# Altium project FM Transmitter.PrjPcb
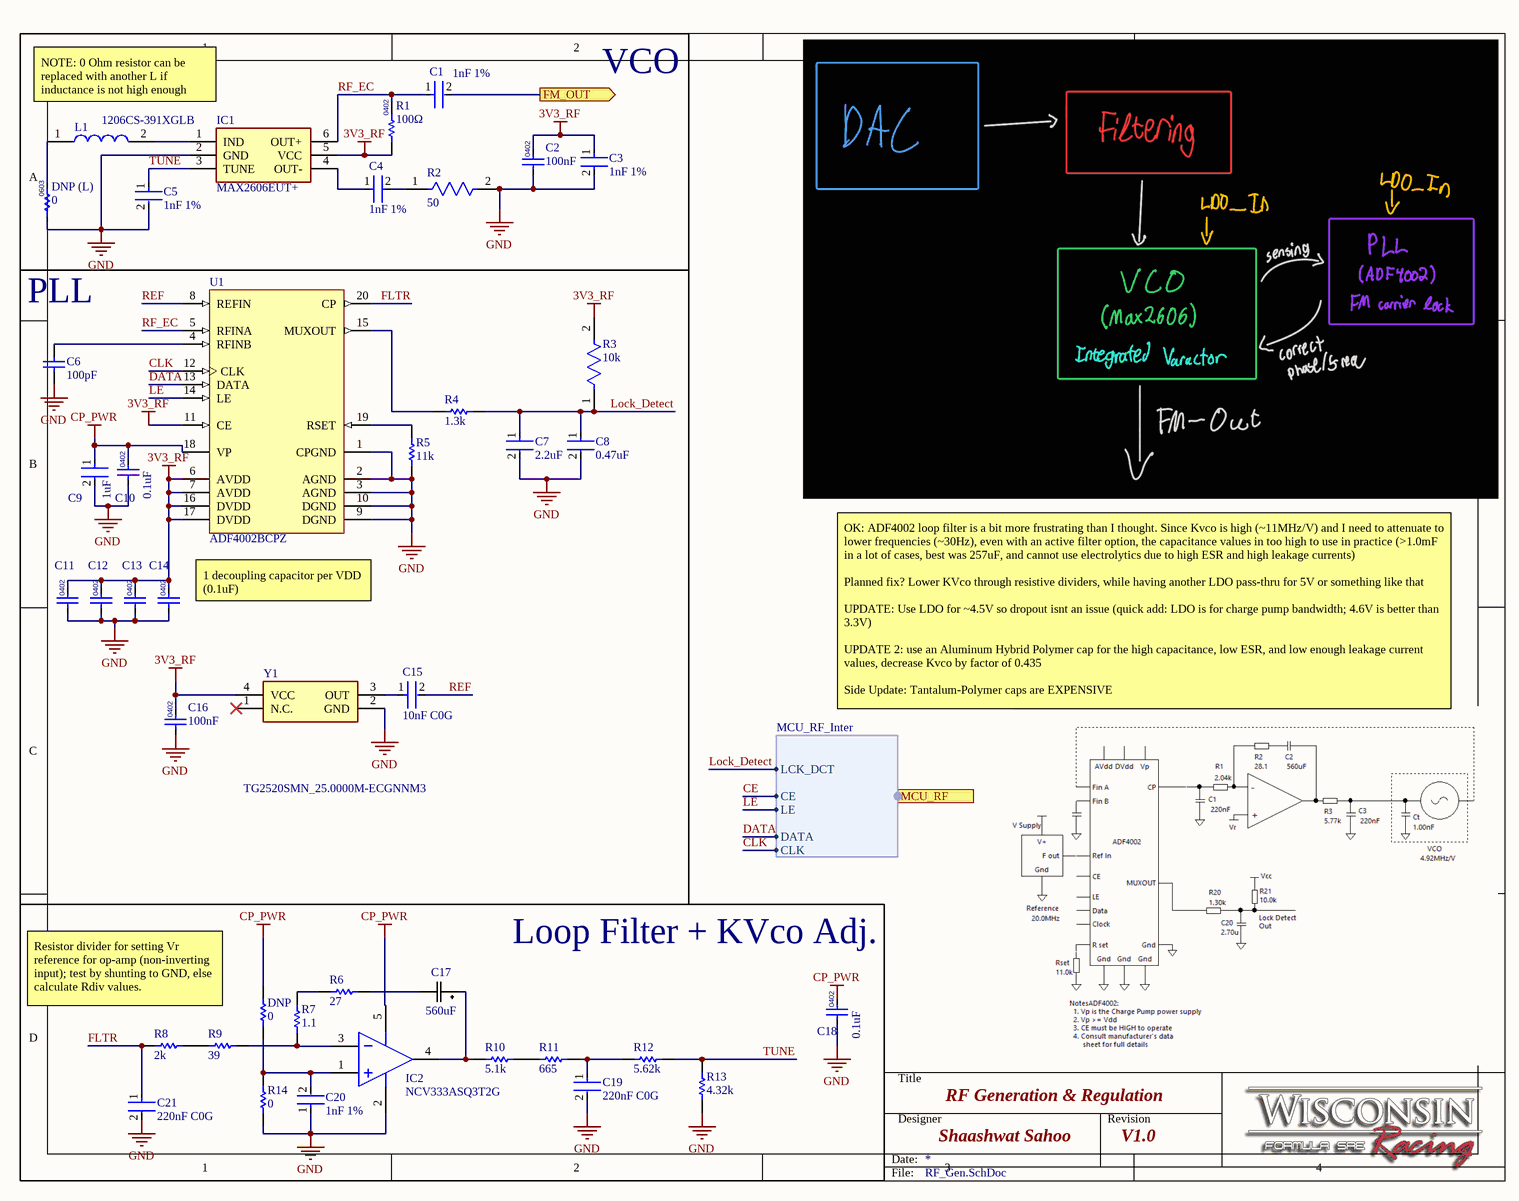
[diagram p0: RF_Gen.SchDoc]
3 sheets, 62 parts. Net scope: flat (ports and power ports of the same name join across sheets).
Sheets:
  RF_Gen.SchDoc
  DAC.SchDoc
  MCU.SchDoc

## Sheet RF_Gen.SchDoc: RF Generation & Regulation
size 279 x 215 mm; Engineer: Shaashwat Sahoo; Revision: V1.0; SheetNumber: 1; SheetTotal: 5; SPICEModelCacheMXYIGOMC: <root> / <DocumentId>MXYIGOMC</DocumentId> / <CacheFrame Number="0"> / <Model Name="cap" Kind="MDL"> / <Text>*Default semiconductor capacitor / .MODEL CAP C()</Text> / </Model> / </CacheFrame> / </root>

### Parts
(Parts that share a designator on the sheet are numbered #1, #2 ... from top to bottom, then left to right.)
C1  1nF 1%  [FP-GRT155-0_05-IPC_A]
C2  100nF  [FP-CC0402-IPC_B]
C3  1nF 1%  [FP-GRT155-0_05-IPC_A]
C4  1nF 1%  [FP-GRT155-0_05-IPC_A]
C5  1nF 1%  [FP-GRT155-0_05-IPC_A]
C6  100pF  [CAPC1005X55X25ML05T10]
C7  2.2uF  [FP-CC0402-MFG]
C8  0.47uF  [FP-GRM155-0_1-IPC_B]
C9  1uF  [FP-GRM155-0_1-IPC_A]
C10  0.1uF  [FP-CC0402-IPC_B]
C11  0.1uF  [FP-CC0402-IPC_B]  (value not drawn)
C12  0.1uF  [FP-CC0402-IPC_B]  (value not drawn)
C13  0.1uF  [FP-CC0402-IPC_B]  (value not drawn)
C14  0.1uF  [FP-CC0402-IPC_B]  (value not drawn)
C15  10nF C0G  [FP-GRM155-0_15-MFG]
C16  100nF  [FP-CC0402-IPC_B]
C17  560uF  [CAP_GY_10X10_NCH]
C18  0.1uF  [FP-CC0402-IPC_B]
C19  220nF C0G  [FP-GRM31C-0_2-e0_3_0_8-IPC_B]
C20  1nF 1%  [FP-GRT155-0_05-IPC_A]
C21  220nF C0G  [FP-GRM31C-0_2-e0_3_0_8-IPC_B]
DNP#1  0  [RESC1005X40X25NL05T10]
DNP_(L)  0  [Res0603-type-2]
IC1  MAX2606EUT+  [SOT95P280X145-6N]
IC2  NCV333ASQ3T2G  [SOT65P210X110-5N]
L1  1206CS-391XGLB  [INDC3622X152N]
R1  value 100Ω  [RESC1005X40X25NL05T10]  (hidden comment: 100 1%)
R2  50  [FP-AC0402-IPC_C]
R3  10k  [FP-AC0402-MFG]
R4  1.3k  [RESC1005X40X25ML05T10]
R5  11k  [RESC1005X40X25NL05T10]
R6  27  [RESC1005X40X25LL05T10]
R7  1.1  [RESC1005X40X25NL05T10]
R8  2k  [RESC1005X35X25NL10T10]
R9  39  [RESC1005X40X25LL05T10]
R10  5.1k  [RESC1005X40X25NL05T10]
R11  665  [RESC1005X40X25ML05T10]
R12  5.62k  [RESC1005X40X25LL05T10]
R13  4.32k  [RESC1005X40X25NL05T10]
R14  0  [RESC1005X40X25NL05T10]
U1  ADF4002BCPZ  [ADI-CP-20-1_M]
Y1  TG2520SMN_25.0000M-ECGNNM3  [TG2520SMN250000MECGNNM3]

### Blocks framed on the sheet
VCO: C1-C5 DNP_(L) IC1 L1 R1 R2
PLL: C6-C16 R3-R5 U1 Y1
Loop Filter + KVco Adj.: C17-C21 DNP#1 IC2 R6-R14

### Ports
FM_OUT (out), MCU_RF (harness MCU_RF_Inter)

### Harnesses
MCU_RF_Inter: LCK_DCT, LE, DATA, CLK, CE

### Nets
3V3_RF: C2.2 C3.1 C11.2 C12.2 C13.2 C14.2 C16.2 IC1.5(VCC) R1.1 R3.2 U1.6(AVDD) U1.7(AVDD) U1.11(CE) U1.16(DVDD) U1.17(DVDD) Y1.4(VCC)
CP_PWR: C9.1 C10.2 C18.2 DNP#1.2 IC2.5(V-) U1.18(VP)
GND: C2.1 C3.2 C5.2 C6.2 C7.2 C8.2 C9.2 C10.1 C11.1 C12.1 C13.1 C14.1 C16.1 C18.1 C19.2 C20.1 C21.2 DNP_(L).1 IC1.2(GND) IC2.2(V-) R2.2 R5.1 R13.1 R14.1 U1.1(CPGND) U1.2(AGND) U1.3(AGND) U1.9(DGND) U1.10(DGND) Y1.2(GND)
CE: port MCU_RF.CE
CLK: U1.12(CLK) ; port MCU_RF.CLK
DATA: U1.13(DATA) ; port MCU_RF.DATA
FLTR: C21.1 R8.1 U1.20(CP)
LE: U1.14(LE) ; port MCU_RF.LE
Lock_Detect: C7.1 C8.1 R3.1 R4.2 ; port MCU_RF.LCK_DCT
REF: C15.2 U1.8(REFIN)
RF_EC: C1.1 IC1.6(OUT+) R1.2 U1.5(RFINA)
TUNE: C5.1 IC1.3(TUNE) R12.2 R13.2
NetC1_2: C1.2 ; port FM_OUT
NetC4_1: C4.1 IC1.4(OUT-)
NetC4_2: C4.2 R2.1
NetC6_1: C6.1 U1.4(RFINB)
NetC15_1: C15.1 Y1.3(OUT)
NetC17_1: C17.1 IC2.4(OUT) R10.1
NetC17_2: C17.2 R6.2
NetC19_1: C19.1 R11.2 R12.1
NetC20_2: C20.2 DNP#1.1 IC2.1(IN+) R14.2
NetDNP_(L)_2: DNP_(L).2 L1.1
NetIC1_1: IC1.1(IND) L1.2
NetIC2_3: IC2.3(IN-) R7.1 R9.2
NetR4_1: R4.1 U1.15(MUXOUT)
NetR5_2: R5.2 U1.19(RSET)
NetR6_1: R6.1 R7.2
NetR8_2: R8.2 R9.1
NetR10_2: R10.2 R11.1

Not connected (* = marked no-connect by the designer): Y1 1(N.C.)*

### Notes on the sheet
- NOTE: 0 Ohm resistor can be replaced with another L if inductance is not high enough
- 1 decoupling capacitor per VDD (0.1uF)
- OK: ADF4002 loop filter is a bit more frustrating than I thought. Since Kvco is high (~11MHz/V) and I need to attenuate to lower frequencies (~30Hz), even with an active filter option, the capacitance values in too high to use in practice (>1.0mF in a lot of cases, best was 257uF, and cannot use electrolytics due to high ESR and high leakage currents)
  Planned fix? Lower KVco through resistive dividers, while having another LDO pass-thru for 5V or something like that
  UPDATE: Use LDO for ~4.5V so dropout isnt an issue (quick add: LDO is for charge pump bandwidth; 4.6V is better than 3.3V)
  UPDATE 2: use an Aluminum Hybrid Polymer cap for the high capacitance, low ESR, and low enough leakage current values, decrease Kvco by factor of 0.435
  Side Update: Tantalum-Polymer caps are EXPENSIVE
- Resistor divider for setting Vr reference for op-amp (non-inverting input); test by shunting to GND, else calculate Rdiv values.
- Title
- Designer
- Revision
- Date:
- File:
- (in symbol CMP-Cap-00006-1) 0402
- (in symbol CMP-Res-00022-2) 0603

### Library data of the parts
C1 C3-C5 C20 = CMP-06035-012909-1: Multi-Layer Ceramic Capacitor 1nF 50V C0G ±1% 0402 Paper T/R / GRT1555C1H102FA02D
C2 C16 = CMP-Cap-00006-1: Ceramic Capacitor, Multilayer, Ceramic, 16V, 10% +Tol, 10% -Tol, X7R, 15% TC, 0.1uF, Surface Mount, 0402; Dielectric: XR7; Tolerance: 10%; Capacitance: 100nF; Voltage Rating: 16V
C6 = CMP-2008-03915-1: Manufacturer: Murata; Part Number: GRM1555C1H101JA01D
C7 = CMP-03422-000618-1: CAP CER 2.2UF 10V X5R 0402; Manufacturer: YAGEO; Manufacturer Part Number: CC0402KRX5R6BB225; Automotive Grade: NA; Temperature Coefficient: 30ppm/°C; Tolerance: 0.1; Material: Ceramic; Automotive: No; Device Class L1: Passive Components; Footprint Url: http://www.yageo.com/exep/pages/download/literatures/UPY-C_GEN_24.pdf; Height: 0.55mm; Temperature Range High: +125°C; Category: Cap; ComponentLink2Description: Datasheet; Lead Free: Yes; Octopart: https://octopart.com/cc0402krx5r6bb225-yageo-30987418; Value: 2.2 uF; Ipc Land Pattern Name: CAPC10050X50; Device Class L3: Ceramic Capacitors; Temperature Characteristic: X5R; Device Class L2: Capacitors; Package: CC0402; RoHS: TRUE; Capacitance: 2.2 uF; Temperature: -55°C to +125°C; Digikey Description: CAP CER 2.2UF 10V X5R 0402; Mouser Description: CC Series 0402 2.2 uF 10 V ±10% Tolerance X5R Multilayer Ceramic Capacitor; Voltage Rating: 10 V; ComponentLink2URL: http://www.yageo.com/documents/recent/UPY-GP_NP0_16V-to-50V_16.pdf; Temperature Range Low: -55°C
C8 = CMP-06035-008741-1: Chip Multilayer Ceramic Capacitors for General Purpose, 0402, 0.47uF, X5R, 15%, 10%, 50V; Capacitance: 470nF; Dielectric: X5R; Voltage Rating (DC): 50V; Width: 500um; Tolerance: 10%; Length: 1mm; Thickness: 500um
C9 = CMP-06035-012596-1: Chip Multilayer Ceramic Capacitors for General Purpose, 0402, 1.0uF, X7R, 15%, 10%, 10V
C10-C14 C18 = CMP-Cap-00006-1: Ceramic Capacitor, Multilayer, Ceramic, 16V, 10% +Tol, 10% -Tol, X7R, 15% TC, 0.1uF, Surface Mount, 0402; Dielectric: XR7; Capacitance: 100nF; Tolerance: 10%; Voltage Rating: 16V
C15 = CMP-06035-053372-1: Chip Multilayer Ceramic Capacitors for General Purpose, 0402, 10000pF, C0G, 30ppm/°C, 5%, 35V
C17 = CMP-034-000012-1: Description; Manufacturer_Name: Nichicon; Copyright: Copyright (C) 2025 Ultra Librarian. All rights reserved.; Design Item ID: GYB1J560MCQ1GS; Manufacturer_Part_Number: GYB1J560MCQ1GS; Source: GYB1J560MCQ1GS.SchLib
C19 C21 = CMP-06035-005862-1: Chip Multilayer Ceramic Capacitors for General Purpose, 1206, 0.22uF, C0G, 30ppm/°C, 5%, 25V
DNP#1 R14 = CMP-1011-00001-2: Manufacturer: Yageo / Phycomp; Part Number: RC0402JR-070RL
DNP_(L) = CMP-Res-00022-2: Fixed Resistor, Metal Glaze/thick Film, 0.1W, 0ohm, Surface Mount, 0603; Tolerance: 0.1%; Power: 100mW; Resistance: 0
IC1 = MAX2606EUT+: Integrated Circuit; Manufacturer_Name: Analog Devices; Datasheet Link: https://datasheets.maximintegrated.com/en/ds/MAX2605-MAX2609.pdf; Height: 1.45mm; Manufacturer_Part_Number: MAX2606EUT+; Mouser Part Number: 700-MAX2606EUT+; Mouser Price/Stock: https://www.mouser.co.uk/ProductDetail/Analog-Devices-Maxim-Integrated/MAX2606EUT%2b?qs=U8%2FOE6X5Fv%2F2oJ3nHVn6vA%3D%3D
IC2 = CMP-006-000098-2: Low Offset Voltage: 10 V max (NCS333); Manufacturer_Name: onsemi; Design Item ID: NCV333ASQ3T2G; Manufacturer_Part_Number: NCV333ASQ3T2G; Source: SamacSys.SchLib; Datasheet Link: https://www.onsemi.com/pub/Collateral/NCS333-D.PDF; Height: 1.1mm; Arrow Part Number: NCV333ASQ3T2G; Arrow Price/Stock: https://www.arrow.com/en/products/ncv333asq3t2g/on-semiconductor?region=nac; Mouser Part Number: 863-NCV333ASQ3T2G; Mouser Price/Stock: https://www.mouser.co.uk/ProductDetail/onsemi/NCV333ASQ3T2G?qs=f9yNj16SXrKU9Ty3EUv2qA%3D%3D
L1 = 1206CS-391XGLB: Inductor; Manufacturer_Name: COILCRAFT; Datasheet Link: https://componentsearchengine.com/Datasheets/2/1206CS-391XGLB.pdf; Height: 1.52mm; Manufacturer_Part_Number: 1206CS-391XGLB
R1 = CMP-00174-2: Res Thick Film 0402 100 Ohm 1% 0.063W(1/16W) ±100ppm/C Pad SMD T/R; Power Rating: 63mW; Power Dissipation: 62.5mW; Working Voltage: 50V; Temperature Coefficient: 100ppm/°C; Harmonized Tariff Schedule (HTS) Code: 8533.21.00.30; Case/Package: 0402; Lifecycle Status: Production; Export Control Classification Number (ECCN) Code: EAR99; Number of Terminals: 2; Max Operating Temperature: 155°C; Military Standard: Not; Tolerance: 1%; China RoHS: Non-Compliant; Case Code (Imperial): 0402; Width: 500µm; Lead Free: Lead Free; Voltage Rating: 50V; Country of Origin: Mainland China, Taiwan; Composition: Thick Film; Mounting Technology: Surface Mount; Termination: SMD/SMT; RoHS: Compliant; Height: 350µm; Min Operating Temperature: -55°C; Voltage Rating (DC): 50V; REACH SVHC: Yes; Packaging: Tape & Reel; Schedule B: 8533210045, 8533210045; Length: 1mm; Introduction Date: 2004-10-04; Pins: 2; Depth: 500µm
R2 = CMP-2002-01779-2: RES 50Ω ±5% 0.063W 0402 / AC0402JR-0750RL; Voltage Rating: 50V; Power Rating: 62.5mW; Max Power Dissipation: 63mW; Temperature Coefficient: 100ppm/°C; Resistance: 50R; Termination: SMD/SMT; Packaging: Tape and Reel; Case Code (Metric): 1005; Min Operating Temperature: -55°C; Case/Package: 0402; Length: 0.039inch; Series: AC; Number of Terminations: 2; Weight: 2.3E-05oz; Tolerance: 5%; Max Operating Temperature: 155°C; Features: Moisture Resistant; Width: 0.5mm; Height: 0.015inch; Resistor Type: Thick Film; Lead Free: Lead Free; Case Code (Imperial): 0402; RoHS Compliant: Yes
R3 = CMP-2002-01790-3: RES 10kΩ ±1% 0.063W 0402; Power Rating: 62.5mW; Voltage Rating: 50V; Temperature Coefficient: 100ppm/°C; Resistance: 10kR; Max Power Dissipation: 63mW; Tolerance: 1%; Military Standard: Not; Construction: Rectangular; Termination: SMD/SMT; Max Operating Temperature: 155°C; Min Operating Temperature: -55°C; Height: 0.015inch; Lead Free: Lead Free; Width: 0.02inch; Case/Package: 0402; Resistor Type: Thick Film; Series: AC; Features: Moisture Resistant; RoHS Compliant: Yes; Number of Terminations: 2; Case Code (Metric): 1005; Length: 0.039inch; Depth: 0.5mm; Size Code: 0402; Packaging: Tape and Reel; Case Code (Imperial): 0402
R4 = CMP-2002-07459-1: Manufacturer: Yageo / Phycomp; Part Number: RC0402FR-071K3L
R5 R10 = CMP-2002-07753-1: Part Number: RC0402FR-075K1L; Manufacturer: Yageo / Phycomp
R6 = CMP-2002-07055-1: Part Number: RC0402FR-0727RL; Manufacturer: Yageo / Phycomp
R7 = CMP-1011-00175-2: Part Number: RC0402FR-071R1L; Manufacturer: Yageo / Phycomp
R8 = CMP-2002-02941-1: Manufacturer: Yageo; Part Number: RT0402BRD072KL
R9 = CMP-1011-00350-2: Manufacturer: Yageo / Phycomp; Part Number: RC0402FR-0739RL
R11 = CMP-2002-07113-1: Part Number: RC0402FR-07665RL; Manufacturer: Yageo / Phycomp
R12 = CMP-2002-07755-1: Part Number: RC0402FR-075K62L; Manufacturer: Yageo / Phycomp
R13 = CMP-1011-00582-2: Part Number: RC0402FR-074K32L; Manufacturer: Yageo / Phycomp
U1 = CMP-0287-00012-1: Phase Detector/Frequency Synthesizer, CP-20-1, Pb-Free, 490 Tray; Max REFin (MHz): 300MHz; Supply Current: 5mA; Norm Phase Noise (dBc/Hz): -222dBc; Max RF Input (MHz): 400MHz; Frequency Range: 5MHz-400MHz; Single/Dual: Single; PackageReference: CP-20-1; Code_JEDEC: MO-220-VGGD-1; ComponentLink1URL: www.analog.com; ComponentLink3Description: Package Specification; PackageVersion: 012508-B; DatasheetVersion: Rev. B; ComponentLink3URL: http://www.analog.com/static/imported-files/packages/PKG_PDF/LFCSP(CP)/CP_20_1.pdf; ComponentLink2Description: Datasheet; ComponentLink1Description: Manufacturer URL; PackageDescription: 20-Lead Lead Frame Chip Scale Package [LFCSP_VQ]; ComponentLink2URL: http://www.analog.com/static/imported-files/data_sheets/ADF4002.pdf
Y1 = TG2520SMN_25.0000M-ECGNNM3: Crystal or Oscillator; Manufacturer_Name: Epson Timing; Manufacturer_Part_Number: TG2520SMN 25.0000M-ECGNNM3; Datasheet Link: https://au.mouser.com/datasheet/2/137/Epson_TG2016SMN_en_1649545-1889946.pdf; Height: 0.8mm; Mouser Part Number: 732-TG252S25ECGNNM3; Mouser Price/Stock: https://www.mouser.co.uk/ProductDetail/Epson-Timing/TG2520SMN-25.0000M-ECGNNM3?qs=d0WKAl%252BL4KZiXJ1i3MlmDQ%3D%3D

## Sheet DAC.SchDoc
size 279 x 215 mm; SheetNumber: 4; SheetTotal: 6; SPICEModelCacheRUGZJIPY: <root> / <DocumentId>RUGZJIPY</DocumentId> / <CacheFrame Number="0"> / <Model Name="cap" Kind="MDL"> / <Text>*Default semiconductor capacitor / .MODEL CAP C()</Text> / </Model> / </CacheFrame> / </root>
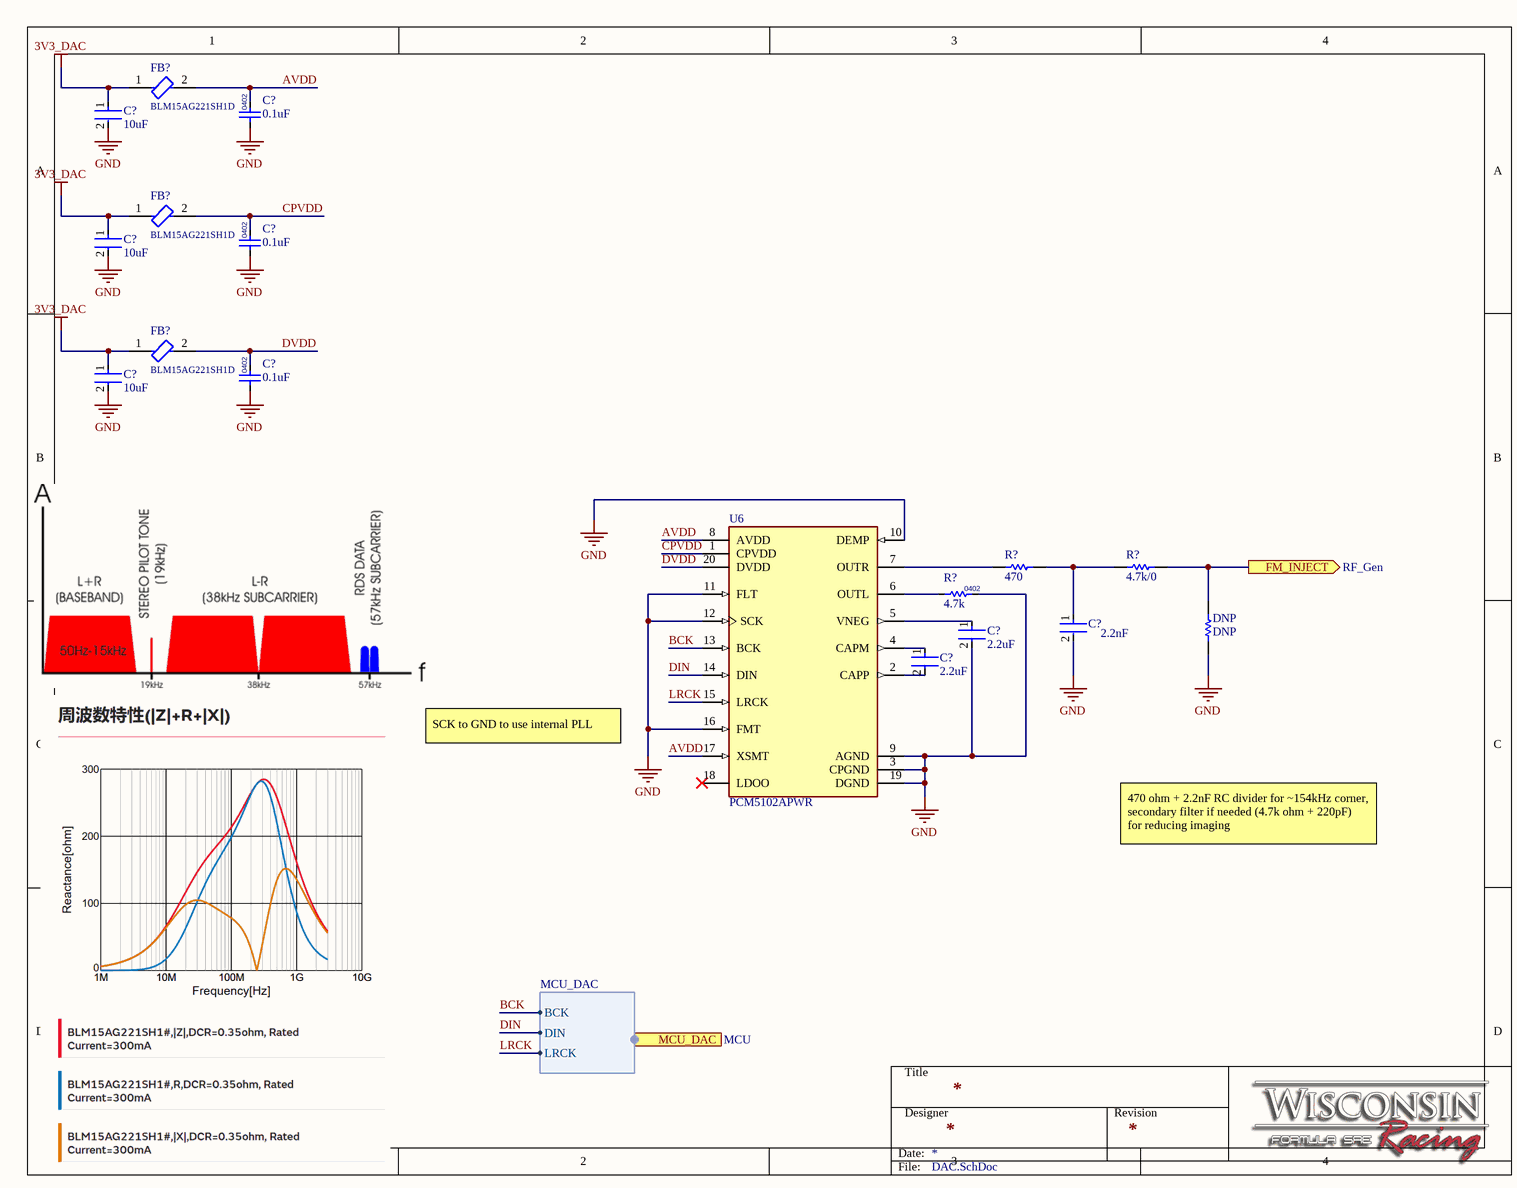
[diagram p1: DAC.SchDoc]

### Parts
(Parts that share a designator on the sheet are numbered #1, #2 ... from top to bottom, then left to right.)
C?#1  10uF  [FP-GRM155-0_2-IPC_A]
C?#2  0.1uF  [FP-CC0402-IPC_B]
C?#3  10uF  [FP-GRM155-0_2-IPC_A]
C?#4  0.1uF  [FP-CC0402-IPC_B]
C?#5  10uF  [FP-GRM155-0_2-IPC_A]
C?#6  0.1uF  [FP-CC0402-IPC_B]
C?#7  2.2nF  [FP-GRM155-0_05-IPC_C]
C?#8  2.2uF  [FP-GRM155-0_2-IPC_B]
C?#9  2.2uF  [FP-GRM155-0_2-IPC_B]
DNP#2  DNP  [RESC1005X40X25NL05T10]
FB?#1  BLM15AG221SH1D  [FP-BLM15-0_05-MFG]
FB?#2  BLM15AG221SH1D  [FP-BLM15-0_05-MFG]
FB?#3  BLM15AG221SH1D  [FP-BLM15-0_05-MFG]
R?#1  470  [RESC1005X40X25ML05T10]
R?#2  4.7k/0  [RESC1005X40X25NL05T10]
R?#3  value 4.7k  [RESC1005X40X25NL05T10]  (hidden comment: 4.7k 1%)
U6  PCM5102APWR  [FP-PW0020A-IPC_A]

### Ports
FM_INJECT (out, see RF_Gen), MCU_DAC (harness MCU_DAC, see MCU)

### Harnesses
MCU_DAC: BCK, DIN, LRCK

### Nets
3V3_DAC: C?#1.1 C?#3.1 C?#5.1 FB?#1.1 FB?#2.1 FB?#3.1
GND: C?#1.2 C?#2.1 C?#3.2 C?#4.1 C?#5.2 C?#6.1 C?#7.2 C?#8.2 DNP#2.1 R?#3.2 U6.3(CPGND) U6.9(AGND) U6.10(DEMP) U6.11(FLT) U6.12(SCK) U6.16(FMT) U6.19(DGND)
AVDD: C?#2.2 FB?#1.2 U6.8(AVDD) U6.17(XSMT)
BCK: U6.13(BCK) ; port MCU_DAC.BCK
CPVDD: C?#4.2 FB?#2.2 U6.1(CPVDD)
DIN: U6.14(DIN) ; port MCU_DAC.DIN
DVDD: C?#6.2 FB?#3.2 U6.20(DVDD)
LRCK: U6.15(LRCK) ; port MCU_DAC.LRCK
NetC?#7_1: C?#7.1 R?#1.2 R?#2.1
NetC?#8_1: C?#8.1 U6.5(VNEG)
NetC?#9_1: C?#9.1 U6.4(CAPM)
NetC?#9_2: C?#9.2 U6.2(CAPP)
NetDNP#2_2: DNP#2.2 R?#2.2 ; port FM_INJECT
NetR?#1_1: R?#1.1 U6.7(OUTR)
NetR?#3_1: R?#3.1 U6.6(OUTL)

Not connected (* = marked no-connect by the designer): U6 18(LDOO)*

### Notes on the sheet
- SCK to GND to use internal PLL
- 470 ohm + 2.2nF RC divider for ~154kHz corner, secondary filter if needed (4.7k ohm + 220pF)  for reducing imaging
- Title
- Designer
- Revision
- Date:
- File:
- (in symbol CMP-Cap-00006-1) 0402

### Library data of the parts
C?#1 C?#3 C?#5 = CMP-06035-061139-1: Chip Multilayer Ceramic Capacitors for General Purpose, 0402, 10uF, X5R, 15%, 20%, 6.3V
C?#2 C?#4 C?#6 = CMP-Cap-00006-1: as C10 on sheet RF_Gen; Tolerance: 10%; Voltage Rating: 16V
C?#7 = CMP-06035-062041-1: Chip Multilayer Ceramic Capacitors for General Purpose, 0402, 2200pF, C0G, 30ppm/°C, 5%, 50V
C?#8 C?#9 = CMP-06035-003072-1: Chip Multilayer Ceramic Capacitors for General Purpose, 0402, 2.2uF, X7R, 15%, 10%, 10V; Case/Package: 0402
DNP#2 R?#2 = CMP-1011-00001-2: as DNP#1 on sheet RF_Gen
FB?#1-FB?#3 = CMP-06046-002173-1: Chip Ferrite Bead, 0402, 220Ω @ 100MHz, 0.35Ω, 25%, 300mA; Impedance: 220R; Number of Lines: 1; DC Resistance (DCR): 350mR; Package Quantity: 10000; Max Operating Temperature: 125°C; Case Code (Imperial): 0402; Ratings: AEC-Q200; Packaging: Tape and Reel; Width: 0.5mm; Core Material: Ferrite; Length: 0.039inch; Max Current Rating: 300mA; REACH SVHC: No SVHC; Weight: 2.3E-05oz; Height: 0.022inch; Max DC Current: 300mA; Series: EMIFIL®, BLM15A_SH; Test Frequency: 100MHz; Min Operating Temperature: -55°C; Termination: SMD/SMT; Mount: Surface Mount; Case Code (Metric): 1005; Depth: 0.55mm; Case/Package: 0402; RoHS Compliant: Yes; Tolerance: 25%; Number of Circuits: 1
R?#1 = CMP-2002-07697-1: Part Number: RC0402FR-07470RL; Manufacturer: Yageo / Phycomp
R?#3 = CMP-00178-1: Res General Purpose Thick Film 0402 4.7K Ohm 1% 1/16W ±100ppm/°C Molded SMD Paper T/R; Power Rating: 63mW; Voltage Rating (AC): 50V; Power Dissipation: 62.5mW; REACH SVHC: Yes; Harmonized Tariff Schedule (HTS) Code: 8533.21.00.30; Composition: Thick Film; Max Operating Temperature: 155°C; Number of Terminals: 2; Min Operating Temperature: -55°C; Depth: 500µm; Introduction Date: 2008-07-18; Case Code (Metric): 1005; Pins: 2; Packaging: Tape & Reel; Height: 350µm; China RoHS: Non-Compliant; Lead Free: Lead Free; Termination: SMD/SMT; Tolerance: 1%; Schedule B: 8533210045, 8533210045; Length: 1mm; Lifecycle Status: Production; Case Code (Imperial): 0402; RoHS: Compliant; Width: 500µm; Mounting Technology: Surface Mount; Temperature Coefficient: 100ppm/°C; Export Control Classification Number (ECCN) Code: EAR99; Country of Origin: Mainland China, Taiwan; Working Voltage: 50V; Voltage Rating: 50V; Case/Package: 0402; Voltage Rating (DC): 50V; Military Standard: Not
U6 = CMP-04861-000013-1: IC DAC 16/24/32BIT 384K 20TSSOP; Power Consumption: 59.4mW; Number of Analog Inputs: 0; Supply Type: Analog; Resolution: 32b; Number of Analog Outputs: 2; Max Power Dissipation: 187mW; Sampling Rate: 384KS/s; Operating Supply Voltage: 3.3V; Number of Bits: 32; Max Supply Voltage: 3.6V; Interface: Serial; Polarity: Unipolar; Min Supply Voltage: 3V; Output Type: Voltage; Signal to Noise Ratio (SNR): 112dB; Contact Plating: Gold; Package Quantity: 2000; Number of Pins: 20; Max Operating Temperature: 85°C; Series: DirectPath™; Case/Package: TSSOP; Conversion Rate: 384KS/s; Number of DAC Channels: 2; Mount: Surface Mount; REACH SVHC: No SVHC; Packaging: Tape and Reel; Number of Converters: 2; Min Operating Temperature: -25°C; Lead Free: Lead Free

## Sheet MCU.SchDoc
size 279 x 215 mm; SheetNumber: 5; SheetTotal: 6; SPICEModelCacheLZXJEGGY: <root> / <DocumentId>LZXJEGGY</DocumentId> / <CacheFrame Number="0"> / <Model Name="cap" Kind="MDL"> / <Text>*Default semiconductor capacitor / .MODEL CAP C()</Text> / </Model> / </CacheFrame> / </root>
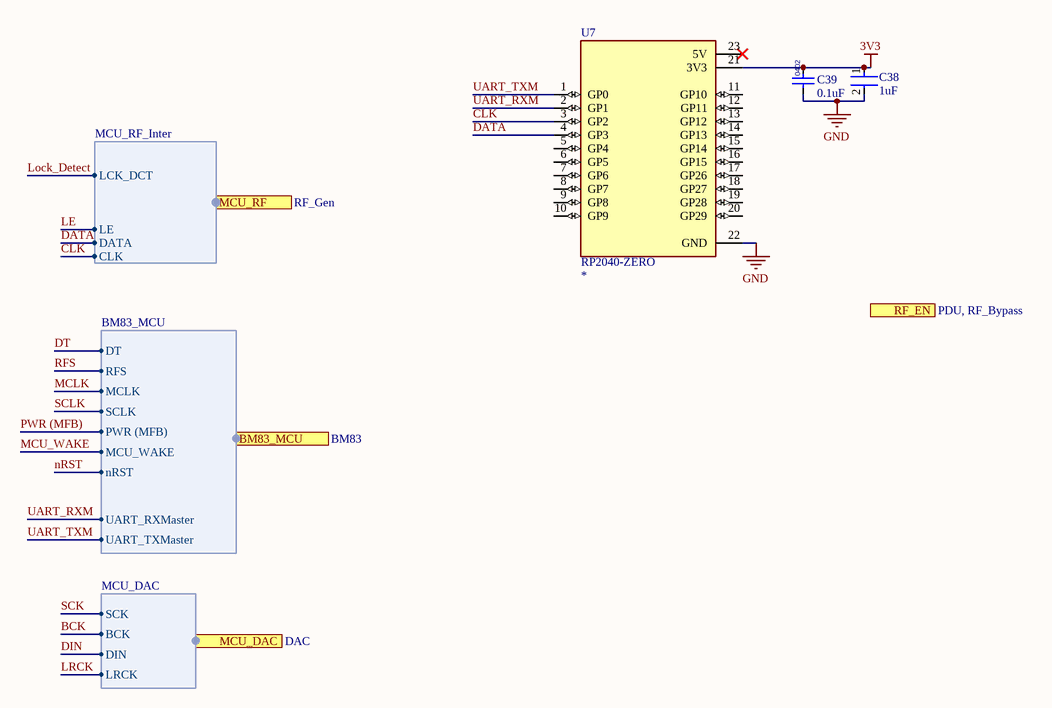
[diagram p2: MCU.SchDoc]

### Parts
C38  1uF  [FP-GRM155-0_1-IPC_C]
C39  0.1uF  [FP-CC0402-IPC_B]
U7  RP2040-ZERO  [MODULE_RP2040-ZERO]

### Ports
BM83_MCU (harness BM83_MCU, see BM83), MCU_DAC (harness MCU_DAC, see DAC), MCU_RF (harness MCU_RF_Inter, see RF_Gen), RF_EN (in, see PDU, RF_Bypass)

### Harnesses
BM83_MCU: MCLK, MCU_WAKE, SCLK, PWR (MFB), RFS, DT, nRST, UART_TXMaster, UART_RXMaster
MCU_RF_Inter: LCK_DCT, LE, DATA, CLK
MCU_DAC: SCK, BCK, DIN, LRCK

### Nets
3V3: C38.1 C39.2 U7.21(3V3)
GND: C38.2 C39.1 U7.22(GND)
CLK: U7.3(GP2) ; port MCU_RF.CLK
DATA: U7.4(GP3) ; port MCU_RF.DATA
DT: port BM83_MCU.DT
MCLK: port BM83_MCU.MCLK
MCU_WAKE: port BM83_MCU.MCU_WAKE
nRST: port BM83_MCU.nRST
PWR (MFB): port BM83_MCU.PWR (MFB)
RFS: port BM83_MCU.RFS
SCK: port MCU_DAC.SCK
SCLK: port BM83_MCU.SCLK
UART_RXM: U7.2(GP1) ; port BM83_MCU.UART_RXMaster
UART_TXM: U7.1(GP0) ; port BM83_MCU.UART_TXMaster

Not connected (* = marked no-connect by the designer): U7 5(GP4) 6(GP5) 7(GP6) 8(GP7) 9(GP8) 10(GP9) 11(GP10) 12(GP11) 13(GP12) 14(GP13) 15(GP14) 16(GP15) 17(GP26) 18(GP27) 19(GP28) 20(GP29) 23(5V)*

### Notes on the sheet
- Title
- Designer
- Revision
- Date:
- File:
- (in symbol CMP-Cap-00006-1) 0402

### Library data of the parts
C38 = CMP-06035-028020-1: Chip Multilayer Ceramic Capacitors for General Purpose, 0402, 1.0uF, X7R, 15%, 10%, 10V / GRM155Z71A105KE01D
C39 = CMP-Cap-00006-1: as C10 on sheet RF_Gen; Tolerance: 10%; Voltage Rating: 16V
U7 = CMP-202-000000-1: Low-Cost, High-Performance Pico-Like MCU Board Based On Raspberry Pi Microcontroller RP2040; MF: Waveshare Electronics; Component Type: Standard; Source: RP2040-ZERO.SchLib; SnapEDA_Link: https://www.snapeda.com/parts/RP2040-ZERO/Waveshare+Electronics/view-part/?ref=snap; Value: *; Package: Package; Design Item ID: RP2040-ZERO; Check_prices: https://www.snapeda.com/parts/RP2040-ZERO/Waveshare+Electronics/view-part/?ref=eda; Pin Count: 23; MP: RP2040-ZERO

## Nets that join several sheets
GND: RF_Gen (30 pins), DAC (17 pins), MCU (C38.2 C39.1 U7.22)
CLK: RF_Gen (U1.12), MCU (U7.3)
DATA: RF_Gen (U1.13), MCU (U7.4)